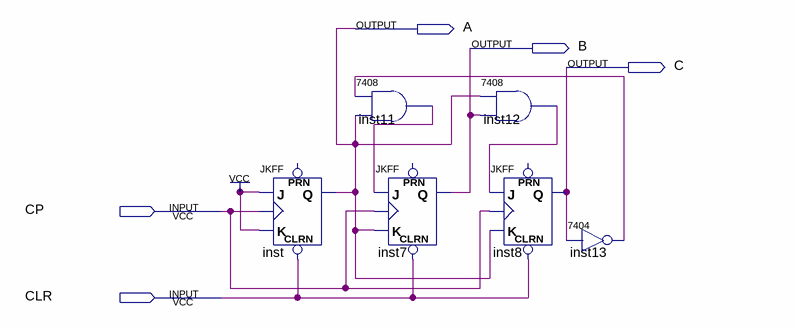
[diagram p0: schematic sheet]
// Quartus schematic Problem2.bdf as structural Verilog: 6 symbols, 5 pins
module Problem2 (
  input  CP,
  input  CLR,
  output A,
  output B,
  output C
);

  wire inst11_1, inst12_1, inst13_1;

  JKFF inst (.CLRN(CLR), .K(1'b1), .J(1'b1), .CLK(CP), .Q(A));  // open: PRN
  \7408  inst11 (.\3 (A), .\2 (inst13_1), .\1 (inst11_1));
  JKFF inst7 (.CLRN(CLR), .K(A), .J(inst11_1), .CLK(CP), .Q(B));  // open: PRN
  \7408  inst12 (.\3 (B), .\2 (A), .\1 (inst12_1));
  JKFF inst8 (.CLRN(CLR), .K(A), .J(inst12_1), .CLK(CP), .Q(C));  // open: PRN
  \7404  inst13 (.\2 (C), .\1 (inst13_1));
endmodule
